# Altium schematic sheet Sheet1.SchDoc
size 500 x 350 mm; SheetNumber: 1; SheetTotal: 1
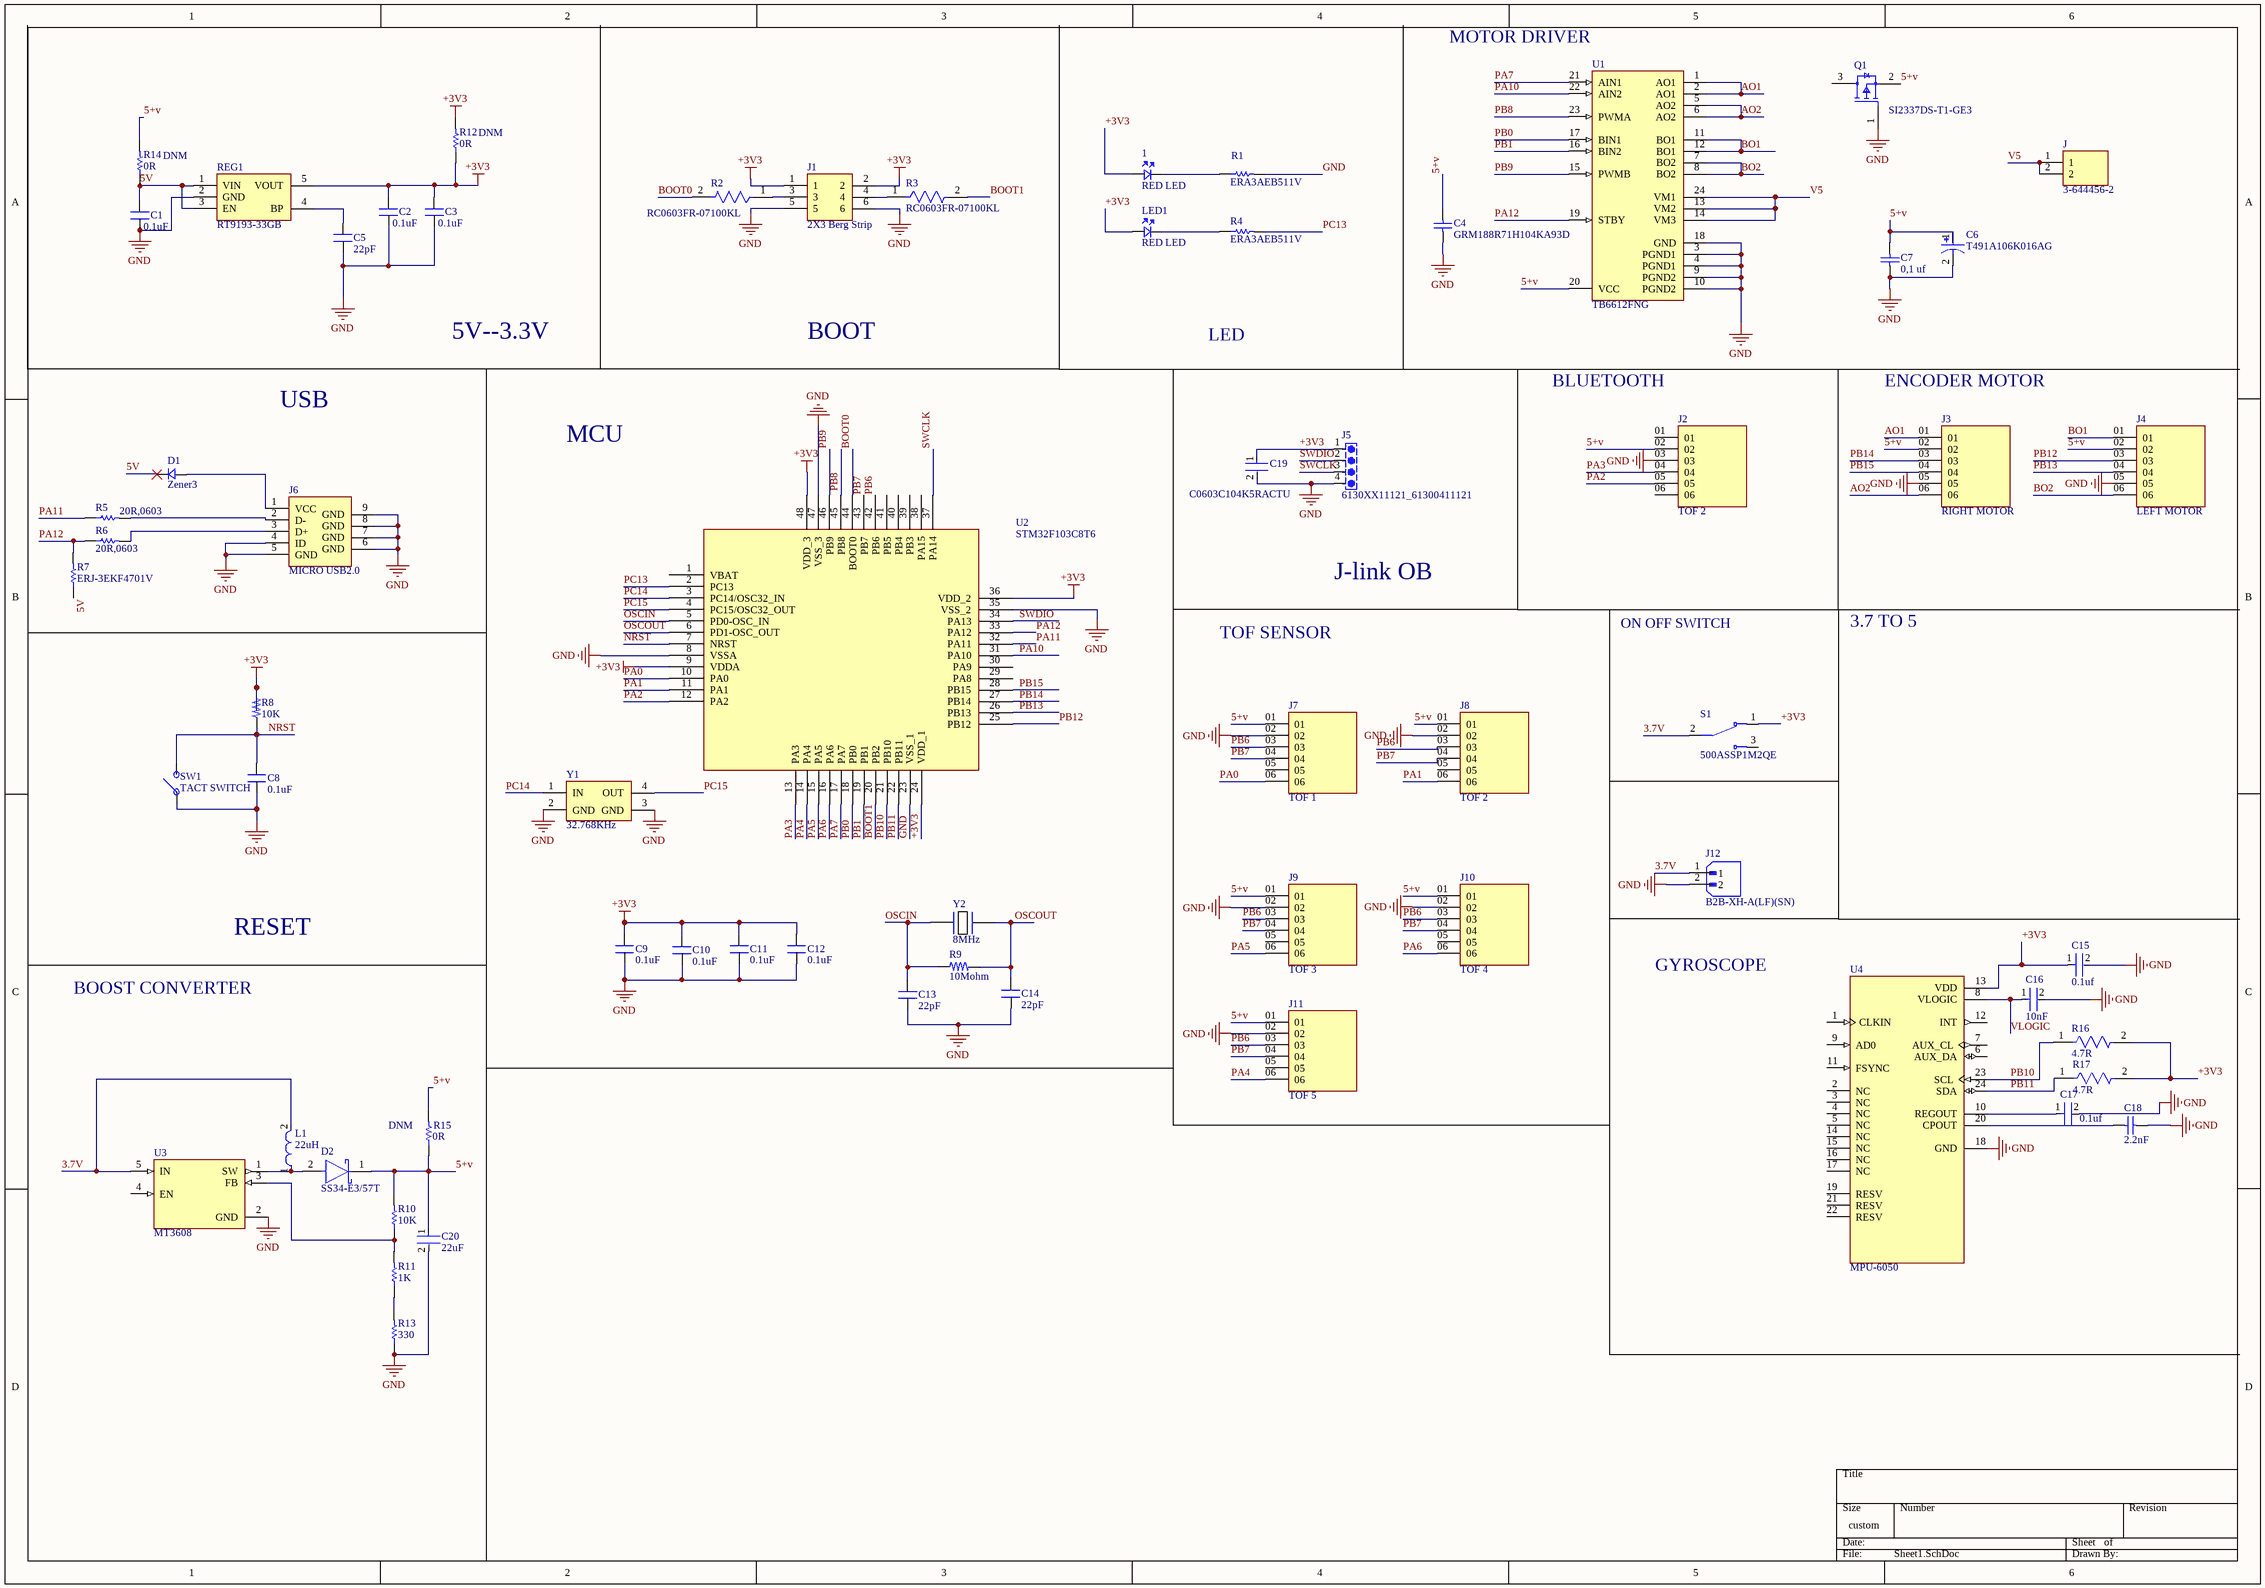
[diagram p0: Sheet1.SchDoc]

## Parts
1  RED LED  [LED_0805]
C1  0.1uF  [CAP_0805]
C2  0.1uF  [CAP_0805]
C3  0.1uF  [CAP_0805]
C4  GRM188R71H104KA93D  [CAPC1608X90X35ML10T15]
C5  22pF  [CAP_0805]
C6  T491A106K016AG  [CAPMP3216X180N]
C7  0,1 uf  [CAPC1608X90X35ML10T15]
C8  0.1uF  [CAP_0805]
C9  0.1uF  [CAP_0805]
C10  0.1uF  [CAP_0805]
C11  0.1uF  [CAP_0805]
C12  0.1uF  [CAP_0805]
C13  22pF  [CAP_0805]
C14  22pF  [CAP_0805]
C15  0.1uf  [FP-C0402-BB-MFG]
C16  10nF  [FP-C0805C-DN-MFG]
C17  0.1uf  [FP-C0402-BB-MFG]
C18  2.2nF  [CAPC2013X94X50LL20T25]
C19  C0603C104K5RACTU  [FP-C0603C-CF-MFG]
C20  22uF  [FP-GRM21B-0_15-MFG]
D1  Zener3  [DIO_SOD80C]
D2  SS34-E3/57T  [FP-95402-MFG]
J  3-644456-2  [TE_3-644456-2]
J1  2X3 Berg Strip  [CON6_100_59D78_TH_ST_Duplicate]
J2  TOF 2  [SAMTEC_MTSW-106-22-S-S-360]
J3  RIGHT MOTOR  [SAMTEC_MTSW-106-22-S-S-360]
J4  LEFT MOTOR  [SAMTEC_MTSW-106-22-S-S-360]
J5  6130XX11121_61300411121  [61300411121]
J6  MICRO USB2.0  [CON_10118192-0001LF_SMD]
J7  TOF 1  [SAMTEC_MTSW-106-22-S-S-360]
J8  TOF 2  [SAMTEC_MTSW-106-22-S-S-360]
J9  TOF 3  [SAMTEC_MTSW-106-22-S-S-360]
J10  TOF 4  [SAMTEC_MTSW-106-22-S-S-360]
J11  TOF 5  [SAMTEC_MTSW-106-22-S-S-360]
J12  B2B-XH-A(LF)(SN)  [JST_B2B-XH-A(LF)(SN)]
L1  22uH  [FP-NR6045-MFG]
LED1  RED LED  [LED_0805]
Q1  SI2337DS-T1-GE3  [FP-S-03946-IPC_A]
R1  ERA3AEB511V  [RESC1608X55X30ML20T20]
R2  RC0603FR-07100KL  [FP-RC0603-0_55-MFG]
R3  RC0603FR-07100KL  [FP-RC0603-0_55-MFG]
R4  ERA3AEB511V  [RESC1608X55X30ML20T20]
R5  20R,0603  [RESC1609X55X30ML10T20]
R6  20R,0603  [RESC1609X55X30ML10T20]
R7  ERJ-3EKF4701V  [RESC1608X55X30NL15T15]
R8  10K  [RES_0805]
R9  10Mohm  [RES_0805]
R10  10K  [RESC1609X50X30NL8T20]
R11  1K  [RESC3216X70X50LL05T20]
R12  0R  [RESC1608X55X25ML10T15]
R13  330  [RESC2013X60X40LL20T25]
R14  0R  [RESC1608X55X25ML10T15]
R15  0R  [RESC1608X55X25ML10T15]
R16  4.7R  [FP-RC0402-0_4-MFG]
R17  4.7R  [FP-RC0402-0_4-MFG]
REG1  RT9193-33GB  [SOT23-5]
S1  500ASSP1M2QE  [SW_500ASSP1M2QE]
SW1  TACT SWITCH  [SW_342_SMD]
U1  TB6612FNG  [TOSH-SSOP-24_M]
U2  STM32F103C8T6  [LQFP-48_19.6_393_58X11_SMD]
U3  MT3608  [SOT95P280X145-6N]
U4  MPU-6050  [QFN50P400X400X95-24N]
Y1  32.768KHz  [XTAL_MC-405 32.7680K-G3]
Y2  8MHz  [XTAL_314_240X47_SMD]

## Nets
+3V3: 1.A C2.1 C3.1 C9.1 C10.1 C11.1 C12.1 C15.1 C19.1 J1.1 J1.2 J5.1 LED1.A R8.2 R12.1 R12.2 R16.2 R17.2 REG1.5(VOUT) S1.1 U2.9(VDDA) U2.24(VDD_1) U2.36(VDD_2) U2.48(VDD_3) U4.13(VDD)
GND: C1.2 C2.2 C3.2 C4.1 C5.1 C6.2 C7.1 C8.2 C9.2 C10.2 C11.2 C12.2 C13.1 C14.1 C15.2 C16.2 C17.2 C18.2 C19.2 C20.2 J1.5 J1.6 J2.03 J3.05 J4.05 J5.4 J6.4(ID) J6.5(GND) J6.6(GND) J6.7(GND) J6.8(GND) J6.9(GND) J7.02 J8.02 J9.02 J10.02 J11.02 J12.2 Q1.1(G) R1.2 R13.1 REG1.2(GND) SW1.1 U1.3(PGND1) U1.4(PGND1) U1.9(PGND2) U1.10(PGND2) U1.18(GND) U2.8(VSSA) U2.23(VSS_1) U2.35(VSS_2) U2.47(VSS_3) U3.2(GND) U4.18(GND) Y1.2(GND) Y1.3(GND)
3.7V: J12.1 L1.2 S1.2 U3.5(IN)
5+v: C4.2 C6.1 C7.2 C20.1 D2.1(C) J2.02 J3.02 J4.02 J7.01 J8.01 J9.01 J10.01 J11.01 Q1.2(S) R10.2 R14.2 R15.1 R15.2 U1.20(VCC)
5V: C1.1 D1.K R7.1 R14.1 REG1.1(VIN) REG1.3(EN)
AO1: J3.01 U1.1(AO1) U1.2(AO1)
AO2: J3.06 U1.5(AO2) U1.6(AO2)
BO1: J4.01 U1.11(BO1) U1.12(BO1)
BO2: J4.06 U1.7(BO2) U1.8(BO2)
BOOT0: R2.2 U2.44(BOOT0)
BOOT1: R3.2 U2.20(PB2)
NRST: C8.1 R8.1 SW1.2 U2.7(NRST)
OSCIN: C13.2 R9.1 U2.5(PD0-OSC_IN) Y2.1
OSCOUT: C14.2 R9.2 U2.6(PD1-OSC_OUT) Y2.2
PA0: J7.06 U2.10(PA0)
PA1: J8.06 U2.11(PA1)
PA2: J2.05 U2.12(PA2)
PA3: J2.04 U2.13(PA3)
PA4: J11.06 U2.14(PA4)
PA5: J9.06 U2.15(PA5)
PA6: J10.06 U2.16(PA6)
PA7: U1.21(AIN1) U2.17(PA7)
PA10: U1.22(AIN2) U2.31(PA10)
PA11: R5.1 U2.32(PA11)
PA12: R6.1 R7.2 U1.19(STBY) U2.33(PA12)
PB0: U1.17(BIN1) U2.18(PB0)
PB1: U1.16(BIN2) U2.19(PB1)
PB6: J7.03 J8.03 J9.03 J10.03 J11.03 U2.42(PB6)
PB7: J7.04 J8.04 J9.04 J10.04 J11.04 U2.43(PB7)
PB8: U1.23(PWMA) U2.45(PB8)
PB9: U1.15(PWMB) U2.46(PB9)
PB10: R16.1 U2.21(PB10) U4.23(SCL)
PB11: R17.1 U2.22(PB11) U4.24(SDA)
PB12: J4.03 U2.25(PB12)
PB13: J4.04 U2.26(PB13)
PB14: J3.03 U2.27(PB14)
PB15: J3.04 U2.28(PB15)
PC13: R4.2 U2.2(PC13)
PC14: U2.3(PC14/OSC32_IN) Y1.1(IN)
PC15: U2.4(PC15/OSC32_OUT) Y1.4(OUT)
SWCLK: J5.3 U2.37(PA14)
SWDIO: J5.2 U2.34(PA13)
V5: J.1 J.2 U1.13(VM2) U1.14(VM3) U1.24(VM1)
VLOGIC: C16.1 U4.8(VLOGIC)
Net1_K: 1.K R1.1
NetC5_2: C5.2 REG1.4(BP)
NetC17_1: C17.1 U4.10(REGOUT)
NetC18_1: C18.1 U4.20(CPOUT)
NetD1_A: D1.A J6.1(VCC)
NetD2_2: D2.2(A) L1.1 U3.1(SW)
NetJ1_3: J1.3 R2.1
NetJ1_4: J1.4 R3.1
NetJ6_2: J6.2(D-) R5.2
NetJ6_3: J6.3(D+) R6.2
NetLED1_K: LED1.K R4.1
NetR10_1: R10.1 R11.2 U3.3(FB)
NetR11_1: R11.1 R13.2

Not connected (* = marked no-connect by the designer): J2 01 06; J7 05; J8 05; J9 05; J10 05; J11 05; Q1 3(D); S1 3; U2 1(VBAT) 29(PA8) 30(PA9) 38(PA15) 39(PB3) 40(PB4) 41(PB5); U3 4(EN); U4 1(CLKIN) 2(NC) 3(NC) 4(NC) 5(NC) 6(AUX_DA) 7(AUX_CL) 9(AD0) 11(FSYNC) 12(INT) 14(NC) 15(NC) 16(NC) 17(NC) 19(RESV) 21(RESV) 22(RESV)

## Notes on the sheet
- MOTOR DRIVER
- (near R14) DNM
- (near R12) DNM
- 5V--3.3V
- BOOT
- LED
- BLUETOOTH
- ENCODER MOTOR
- USB
- MCU
- J-link OB
- ON OFF SWITCH
- 3.7 TO 5
- TOF SENSOR
- RESET
- GYROSCOPE
- BOOST CONVERTER
- (near R15) DNM

## Library data of the parts
1 LED1 = LED-RED_10mA-0805: Red 621nm LED Indication - Discrete 2V 0805 (2012 Metric); Manufacturer: Lite-On Inc.; Manufacturer Part Number: LTST-C170EKT; Case/ Package: 0805; Supplier-1: Digikey; Supplier Part Number-1: 160-1178-1-ND
C1-C3 C8-C12 = CAP_0.1uF-50V-5%-0805: 0.1µF ±5% 50V Ceramic Capacitor X7R 0805 (2012 Metric); Manufacturer: KEMET; Manufacturing Part Number: C0805C104J5RACTU; Case/Package: 0805 (2012 Metric); Supplier-1: Digikey; Supplier Part Number-1: 399-1171-1-ND
C4 C7 = CMP-2100-03643-1: Chip Capacitor, 0.1 uF, +/- 10%, 50 V, -55 to 125 degC, 0603 (1608 Metric), RoHS, Tape and Reel; Manufacturer: Murata; Dielectric Material: Ceramic; Voltage Rating: 50V; Capacitance: 100nF; Dielectric: X7R; Insulation Resistance: 10GR; Case Code (Metric): 1608; Lead Free: LeadFree; Depth: 0.8mm; Number of Pins: 2; Radiation Hardening: No; Case/Package: 0603; Manufacturer URL: http://www.murata.com/; Packaging: TapeandReel; Length: 1.6mm; Contact Plating: Tin; Datasheet URL: http://psearch.en.murata.com/capacitor/product/GRM188R71H104KA93%23.pdf; Tolerance: 10%; Case Code (Imperial): 0603; Min Operating Temperature: -55degC; RoHSCompliant: true; Voltage: 50V; Termination: SMD/SMT; Mount: SurfaceMount; Material: Ceramic; Package Quantity: 1; Height: 0.8mm; Thickness: 0.035inch; REACH SVHC: NoSVHC; Max Operating Temperature: 125degC; Width: 0.8mm; Package Reference: 0603; Voltage Rating (DC): 50V; Datasheet Version: 42675.0; Package Description: 2-Pin Surface Mount Device, Body 1.6 x 0.8 mm
C5 C13 C14 = CAP_22pF-50V-5%-0805: 22pF ±5% 50V Ceramic Capacitor C0G, NP0 0805 (2012 Metric); Manufacturer: KEMET; Manufacturer Part Number: C0805C220J5GACTU; Case/Package: 0805; Supplier-1: Digikey; Supplier Part Number-1: 399-1113-1-ND
C6 = T491A106K016AG: 10ÂµF Molded Tantalum Capacitors 16V 1206 (3216 Metric) 3Ohm; MF: KEMET; Price: None; Value: *; Check_prices: https://www.snapeda.com/parts/T491A106K016AG/KEMET/view-part/1691630/?ref=eda; Package: 1206 KEMET; SnapEDA_Link: https://www.snapeda.com/parts/T491A106K016AG/KEMET/view-part/1691630/?ref=snap; MP: T491A106K016AG; Purchase-URL: https://pricing.snapeda.com/search/part/T491A106K016AG/?ref=eda; Availability: Warning
C15 C17 = CMP-2008-02108-2: CAP CER 0.1UF 16V X7R 0402; Manufacturer: Kemet; Manufacturer Part Number: C0402C104K4RACTU; Value: 0.10 μF; Tolerance: 0.1; Material: Ceramic; Temperature Coefficient: 15%; Voltage Rating: 16 V; Package: C0402-BB; Automotive: No; Ipc Land Pattern Name: CAPC10050X50; Device Class L3: Ceramic Capacitors; Capacitance: 0.10 μF; Octopart: https://octopart.com/c0402c104k4ractu-kemet-94158; Temperature Characteristic: X7R; Mouser Description: Cap Ceramic 0.1uF 16V X7R 10% SMD 0402 125?C Paper T/R - Tape and Reel (Alt: C0402C104K4RAC TU); ComponentLink2Description: Datasheet; Temperature Range Low: -55°C; RoHS: TRUE; Device Class L1: Passive Components; Temperature Range High: +125°C; Device Class L2: Capacitors; ComponentLink2URL: https://content.kemet.com/datasheets/KEM_C1002_X7R_SMD.pdf; Category: Cap; Height: 0.55mm; Temperature: -55°C to +125°C; Lead Free: Yes; Digikey Description: CAP CER 0.1UF 16V X7R 0402
C16 = CMP-2007-00259-2: CAP CER 10000PF 200V X7R 0805; Manufacturer Part Number: C0805C103K2RACTU; Manufacturer: KEMET; Material: Ceramic; Temperature Coefficient: 30ppm/°C; Capacitance: 10,000 pF; Tolerance: 0.1; Value: 10,000 pF; Device Class L2: Capacitors; Voltage Rating: 200 V; Temperature Range High: +125°C; ComponentLink2Description: Datasheet; Height: 0.88mm; Octopart: https://octopart.com/c0805c103k2ractu-kemet-9138347; ComponentLink2URL: https://content.kemet.com/datasheets/KEM_C1003_C0G_SMD.pdf; Category: Cap; Temperature: -55°C to +125°C; Temperature Range Low: -55°C; Digikey Description: CAP CER 10000PF 200V X7R 0805; Temperature Characteristic: X7R; Automotive: No; Device Class L3: Ceramic Capacitors; Mouser Description: KEMET - C0805C103K2RACTU - CAP, MLCC, X7R, 10NF, 200V, 0805; RoHS: TRUE; Device Class L1: Passive Components; Lead Free: Yes; Package: C0805C-DN; Ipc Land Pattern Name: CAPC200125X78
C18 = CMP-2007-04184-1: Part Number: 08051C222JAT2A; Manufacturer: AVX Interconnect / Elco
C19 = CMP-2006-03061-2: CAP CER 0.1UF 50V X7R 0603; Manufacturer: KEMET; Tolerance: 0.1; Temperature Coefficient: 30ppm/°C; Material: Ceramic; Automotive Grade: Grade 1; Value: 0.10 μF; Temperature: -55°C to +125°C; RoHS: TRUE; Temperature Range High: +125°C; Lead Free: Yes; Octopart: https://octopart.com/c0603c104k5ractu-kemet-139244; Digikey Description: CAP CER 0.1UF 50V X7R 0603; Category: Cap; Package: C0603C-CF; ComponentLink2Description: Datasheet; Temperature Range Low: -55°C; Device Class L1: Passive Components; Voltage Rating: 50 V; Automotive: Yes; Device Class L3: Ceramic Capacitors; ComponentLink2URL: https://api.kemet.com/component-edge/download/datasheet/C0603C100J5GACAUTO.pdf; Capacitance: 0.10 μF; Device Class L2: Capacitors; Manufacturer Part Number: C0603C104K5RACTU; Temperature Characteristic: X7R; Height: 0.87mm
C20 = CMP-2007-03385-2: Chip Multilayer Ceramic Capacitors for General Purpose, 0805, 22uF, X5R, 15%, 20%, 6.3V; Material: Ceramic; Max Operating Temperature: 85°C; Voltage: 6.3V; Min Operating Temperature: -55°C; Case/Package: 0805; Thickness: 0.053inch; Dielectric: X5R; Packaging: Tape and Reel; Depth: 1.25mm; Termination: SMD/SMT; Voltage Rating (DC): 6.3V; Radiation Hardening: No; Tolerance: 20%; Mount: Surface Mount; Lead Free: Lead Free; Package Quantity: 1; REACH SVHC: No SVHC; Voltage Rating: 6.3V; Capacitance: 22uF; Length: 2mm; Case Code (Imperial): 0805; Case Code (Metric): 2012; Width: 0.049inch; Height: 1.25mm
D1 = DIO-Z_3.3V-0.5W-SOD80C: Zener Diode 3.3V 500mW ±5% Surface Mount LLDS; MiniMelf; Manufacturer: Nexperia USA Inc.; Manufacturing Part Number: BZV55-C3V3,115; Case/Package: SOD80C; Supplier-1: Digikey; Supplier Part Number-1: 1727-4970-1-ND
D2 = CMP-02539-000012-1: DIODE SCHOTTKY 40V 3A DO214AB; Manufacturer: Vishay; Max Junction Temp: +150°C; Peak Reverse Current: 0.5mA; Max Surge Forward Current: 100A; Standoff Height: 0mm; ComponentLink2Description: Datasheet; Device Class L3: Schottky Diodes; Height: 2.62mm; Max Repetitive Reverse Voltage: 40V; Lead Free: Yes; Package: 95402; Temperature Range High: +150°C; ComponentLink2URL: http://www.vishay.com/docs/88751/ss32.pdf; Temperature: -55°C to +150°C; Footprint Url: http://www.vishay.com/docs/95402/smc.pdf; Automotive: No; Forward Current: 3A; Category: Diode; Manufacturer Part Number: SS34-E3/57T; RoHS: TRUE; Device Class L2: Diodes; Mouser Description: Schottky Diodes & Rectifiers 3.0 Amp 40 Volt; Octopart: https://octopart.com/ss34-e3%2F57t-vishay-39552907; Temperature Range Low: -55°C; Device Class L1: Discrete Semiconductors; Digikey Description: DIODE SCHOTTKY 40V 3A DO214AB
J = 3-644456-2: Connector Unshrouded Header HDR 2 Position 2.54mm Solder Straight Thru-Hole; Number_of_Positions: 2; Centerline_Pitch: 2.54 mm[.1 in]; MF: TE Connectivity; Digi-Key_Part_Number: A31112-ND; Product_Type: Connector; TE_purchase_URL: https://www.te.com/usa-en/product-3-644456-2.html?te_bu=Cor&te_type=disp&te_campaign=seda_glo_cor-seda-global-disp-prtnr-fy19-seda-model-bom-cta_sma-317_1&elqCampaignId=32493; Value: *; MP: 3-644456-2; Package: None; SnapEDA_Link: https://www.snapeda.com/parts/3-644456-2/TE%20Connectivity%20AMP%20Connectors/view-part/520887/?ref=snap; EU_RoHS_Compliance: Compliant; Digi-Key_Purchase_URL: https://www.digikey.com/product-detail/en/te-connectivity-amp-connectors/3-644456-2/A31112-ND/698344?utm_source=snapeda&utm_medium=aggregator&utm_campaign=symbol
J1 = CON-BS-PLG_2X3-100-TH-ST: 6 pin, 2 row, 2.54mm pitch bergstrip; Manufacturer: NA; Manufacturer Part Number: NA; Case/Package: TH; Supplier-1: NA; Supplier Part Number-1: NA
J2-J4 J7-J11 = MTSW-106-22-S-S-360: Price: None; Value: *; MP: MTSW-106-22-S-S-360; Package: None; Availability: Unavailable
J5 = 6130XX11121_61300411121: 4 pins, 1 row, straight, gold plating; MF: Wurth Electronics; SnapEDA_Link: https://www.snapeda.com/parts/61300411121/Wurth+Electronics/view-part/?ref=snap; Package: None; Value: *; MP: 61300411121; Check_prices: https://www.snapeda.com/parts/61300411121/Wurth+Electronics/view-part/?ref=eda
J6 = CON-USB_10118192-0002LF-SMD: USB - micro B USB 2.0 Receptacle Connector 5 Position Surface Mount, Right Angle; Manufacturer: Amphenol ICC (FCI); Manufacturing Part Number: 10118192-0002LF; Case/Package: SMD; Supplier-1: Digikey; Supplier Part Number-1: 609-5379-1-ND
J12 = B2B-XH-A(LF)(SN): Connector Header Through Hole 2 position 0.098 (2.50mm); MF: JST Sales America Inc.; SnapEDA_Link: https://www.snapeda.com/parts/B2B-XH-A(LF)(SN)/JST+Sales+America+Inc./view-part/?ref=snap; Package: None; Value: *; MP: B2B-XH-A(LF)(SN); Check_prices: https://www.snapeda.com/parts/B2B-XH-A(LF)(SN)/JST+Sales+America+Inc./view-part/?ref=eda
L1 = CMP-14484-000872-1: Shielded Wirewound Inductor 22uH 20% 1.5A 0.1495Ω SMD; DC Resistance (DCR): 149.5mR; Self Resonant Frequency: 7MHz; Core Material: Ferrite; Saturation Current: 1.9A; Test Frequency: 100kHz; Mount: Surface Mount; RMS Current (Irms): 1.5A; Packaging: Tape and Reel; RoHS Compliant: Yes; Termination: SMD/SMT; Resistor Type: Wirewound; Inductance: 22uH; Inductance Tolerance: 20%; Number of Pins: 2; Series: NR; Height: 4.5mm; Package Quantity: 1500; Shielding: Shielded; Max Operating Temperature: 120°C; Length: 0.236inch; Halogen Free: Halogen Free; Width: 0.236inch; Min Operating Temperature: -25°C; Current Rating: 1.5A; Height - Seated (Max): 0.177inch; Case/Package: Nonstandard; Max DC Current: 1.5A; Tolerance: 20%
Q1 = CMP-02550-000312-1: MOSFET P-CH 80V 2.2A SOT23-3; Rise Time: 18ns; Power Dissipation: 760mW; Number of Channels: 1; Gate to Source Voltage (Vgs): 20V; Polarity: P-CHANNEL; Drain to Source Voltage (Vdss): -80V; On-State Resistance: 270MR; Threshold Voltage: -4V; Input Capacitance: 500pF; Element Configuration: Single; Fall Time: 12ns; Turn-On Delay Time: 15ns; Turn-Off Delay Time: 20ns; Continuous Drain Current (ID): 1.2A; Number of Pins: 3; Height: 1.02mm; Radiation Hardening: No; Mount: Surface Mount; Packaging: Tape and Reel; Drain to Source Breakdown Voltage: -80V; Contact Plating: Tin; Case/Package: SOT-23-3; Lead Free: Lead Free; Series: TrenchFET®; Drain-source On Resistance-Max: 270MR; Width: 1.4mm; Nominal Vgs: -4V; Length: 3.04mm; Reach SVHC Compliant: Yes; RoHS Compliant: Yes; Weight: 0.050717oz; Package Quantity: 1; Rds On Max: 270mR; Drain to Source Resistance: 270mR; Min Operating Temperature: -55°C; Number of Elements: 1; Max Power Dissipation: 760mW; Max Operating Temperature: 150°C
R1 R4 = CMP-2000-00084-1: Manufacturer: Panasonic; Part Number: ERA3AEB511V
R2 R3 = CMP-2100-03662-2: RES SMD 100K OHM 1% 1/10W 0603; Voltage Rating (DC): 50V; Resistance: 100kR; Max Power Dissipation: 100mW; Temperature Coefficient: 100ppm/°C; Working Voltage: 75V; Length: 1.6mm; Lead Free: Lead Free; Number of Terminations: 2; Packaging: Tape and Reel; Voltage Rating: 50V; Termination: SMD/SMT; Width: 0.8mm; Resistor Type: Thick Film; Resistance Tolerance: 1%; Features: Moisture Resistant; Height: 0.45mm; Construction: Rectangular; Case/Package: 0603; Military Standard: Not; Case Code (Imperial): 0603; Series: RC; Technology: THICK FILM; Depth: 0.8mm; RoHS Compliant: Yes; REACH SVHC: No SVHC; Min Operating Temperature: -55°C; Case Code (Metric): 1608; Max Operating Temperature: 155°C; Power Rating: 100mW; Number of Pins: 2; Tolerance: 1%
R5 R6 = CMP-2000-03731-1: Manufacturer: Vishay Dale; Part Number: TNPW060320R0BEEA
R7 = CMP-1012-00586-3: Precision Thick Film Chip Resistor, 4.7 KOhm, +/- 1%, -55 to 155 degC, 0603 (1608 Metric), RoHS, Tape and Reel; Resistance: 220 Ohm; Voltage Rating: 50 V; Elements: 4; Case\Package: 1205; Tolerance: 5%; Power Rating: 250 mW; PackageReference: 0603; Max Operating Temperature: 125 degC; REACH SVHC: No SVHC; Width: 0.063 inch; Length: 0.126 inch; Height: 0.024 inch; Mount: Surface Mount; Package Quantity: 1; DatasheetVersion: Apr-15; ComponentLink1Description: Manufacturer URL; Min Operating Temperature: -55 degC; Packaging: Tape and Reel; Radiation Hardening: No; ComponentLink2URL: http://industrial.panasonic.com/cdbs/www-data/pdf/RDA0000/AOA0000C86.pdf; Case Code (Metric): 3216; Pins: 8; Case Code (Imperial): 1206; Type (Resistor): Thick Film; RoHSCompliant: true; ComponentLink2Description: Datasheet; PackageDescription: 2-Pin Surface Mount Device, Body 1.6 x 0.85 mm; ComponentLink1URL: http://www.panasonic.com/
R8 = RES_10K-0.125W-1%-0805: 10 kOhms ±1% 0.125W, 1/8W Chip Resistor 0805 (2012 Metric) Moisture Resistant Thick Film; Manufacturer: Yageo; Manufacturing Part Number: RC0805FR-0710KL; Case/Package: 0805; Supplier-1: Digikey; Supplier Part Number-1: 311-10.0KCRCT-ND
R9 = RES_10MOHM-0.125W-1%-0805: 10 MOhms ±1% 0.125W, 1/8W Chip Resistor 0805 (2012 Metric) Automotive AEC-Q200, High Voltage Thick Film; Manufacturer: Rohm Semiconductor; Manufacturing Part Number: KTR10EZPF1005; Case/Package: 0805 (2012 Metric); Supplier-1: Digikey; Supplier Part Number-1: RHM10.0MAHCT-ND
R10 = CMP-1666-00005-4: Chip Resistor, 10 KOhm, +/- 1%, 100 mW, -55 to 155 degC, 0603 (1608 Metric), RoHS, Tape and Reel; Manufacturer: Vishay Semiconductor; Voltage Rating: 75 V; Max Operating Temperature: 155 degC; PackageDescription: 2-Pin Surface Mount Device, Body 1.575 x 0.85 mm; ComponentLink1Description: Manufacturer URL; RoHSCompliant: true; PackageReference: 0603; REACH SVHC: Unknown; Length: 1.55 mm; DatasheetVersion: 06/2012; Packaging: Tape and Reel; Min Operating Temperature: -55 degC; Mounting Technology: Surface Mount; ComponentLink2URL: https://datasheet.ciiva.com/11809/0900766b80d98afc-11809037.pdf; Height: 0.45 mm; ComponentLink2Description: Datasheet; Package Quantity: 5000; ComponentLink1URL: http://www.vishay.com/
R11 = CMP-2003-00017-1: Manufacturer: Panasonic; Part Number: ERJ-8ENF1001V
R12 R14 R15 = CMP-2100-03667-1: Chip Resistor, 0 Ohm, +/- 5%, 0.1 W, -55 to 155 degC, 0603 (1608 Metric), RoHS, Tape and Reel; Manufacturer: Yageo; Temperature Coefficient: 200ppm/degreesC; Voltage Rating: 50V; Power Rating: 100mW; Resistance: 0mOhm; Width: 0.8mm; Max Operating Temperature: 155degC; Tolerance: 5%; Package Reference: 0603; Height: 0.45mm; Depth: 0.8mm; Package Description: 2-Pin Surface Mount Device, Body 1.6 x 0.8 mm; Termination: SMD/SMT; Package Quantity: 5000; Case/Package: 0603; Case Code (Imperial): 0603; Radiation Hardening: No; Number of Pins: 2; Length: 1.6mm; Lead Free: LeadFree; Voltage Rating (DC): 50V; Military Standard: Not; Datasheet URL: http://www.yageo.com/NewPortal/yageodocoutput?fileName=/pdf/R-Chip/PYu-RC_Group_51_RoHS_L_5.pdf; Manufacturer URL: http://www.yageo.com/; Packaging: TapeandReel; Case Code (Metric): 1608; Min Operating Temperature: -55degC; Composition: ThickFilm; RoHSCompliant: true; Contact Plating: Tin; Datasheet Version: Rev. 5, 10/2016; REACH SVHC: NoSVHC
R13 = CMP-2001-00628-1: Manufacturer: Panasonic; Part Number: ERA6AEB331V
R16 R17 = CMP-2002-08011-2: Tolerance: 5%; Power Rating: 63mW; Resistance: 4.7kΩ; Voltage Rating: 50V; Temperature Coefficient: 100ppm/°C; Composition: Thick Film; Max Operating Temperature: 155°C; Case/Package: 0402; Depth: 500µm; Packaging: Tape & Reel; Number of Pins: 2; Schedule B: 8533210045, 8533210045; Case Code (Imperial): 0402; Termination: SMD/SMT; Military Standard: Not; Lead Free: Lead Free; Width: 500µm; REACH SVHC: No SVHC; Max Power Dissipation: 63mW; Voltage Rating (AC): 50V; Features: Moisture Resistant; Min Operating Temperature: -55°C; Number of Terminations: 2; RoHS: Compliant; Height: 350µm; Voltage Rating (DC): 50V; Length: 1mm
REG1 = REG_3.3V-5.5V-0.3A-SOT-23-5: Linear Voltage Regulator IC 1 Output 300mA SOT-23-5; Manufacturer: Richtek USA Inc.; Manufacturer Part Number: RT9193-33GB; Case/ Package: SOT-23-5; Supplier-1: Digikey; Supplier Part Number-1: 1028-1014-1-ND
S1 = 500ASSP1M2QE: 1P2T Sub-miniature Slide Switch; MF: E-Switch; Check_prices: https://www.snapeda.com/parts/500ASSP1M2QE/E-Switch/view-part/?ref=eda; Value: *; Availability: In Stock; MP: 500ASSP1M2QE; Price: None; Package: None; SnapEDA_Link: https://www.snapeda.com/parts/500ASSP1M2QE/E-Switch/view-part/?ref=snap; Purchase-URL: https://pricing.snapeda.com/search/part/500ASSP1M2QE/?ref=eda
SW1 = SW_KSR223GLFG-SMD: Tactile Switch SPST-NO Top Actuated Surface Mount; Manufacturer: C&K; Manufacturing Part Number: KSR223GLFG; Case/Package: SMD; Supplier-1: Digikey; Supplier Part Number-1: 401-1704-1-ND
U1 = CMP-1773-00001-1: Driver IC for Dual DC Motor, 15 V, -20 to 85 degC, 24-Pin SSOP, RoHS, Tape and Reel; Elements: 2; Max Power Dissipation: 200 mW; Max Surge Current: 100 mA; Element Configuration: Common Cathode; Case\Package: TO-236-3; Forward Voltage: 1 V; Peak Reverse Current: 0.1 uA; Forward Current: 70 mA; Recovery Time: 5 ns; Radiation Hardening: No; Packaging: Tape and Reel; ComponentLink2Description: Datasheet; REACH SVHC: No SVHC; ComponentLink2URL: https://toshiba.semicon-storage.com/info/docget.jsp?did=10660&prodName=TB6612FNG; RoHSCompliant: true; DatasheetVersion: Oct-14; PackageDescription: 24-Pin Shrink Small Outline Package Integrated Circuit, Body 7.8 x 5.6 mm, Pitch 0.65 mm; Package Quantity: 3000; Length: 3 mm; Pins: 3; Mount: Surface Mount; ComponentLink1Description: Manufacturer URL; PackageReference: SSOP-24; ComponentLink1URL: http://www.toshiba.com/; Width: 1.4 mm; Max Operating Temperature: 125 degC; Height: 1.1 mm; Min Operating Temperature: -55 degC
U2 = IC-STM32F103C8T6 _1: ARM® Cortex®-M3 STM32F1 Microcontroller IC 32-Bit 72MHz 64KB (64K x 8) FLASH; Manufacturer: STMicroelectronics; Manufacturer Part Number: STM32F103C8T6; Case/Package: 48-LQFP; Supplier-1: Digikey; Supplier Part Number-1: 497-6063-ND
U3 = MT3608: High Efficiency 1.2MHz2A Step Up Converter; MF: Aerosemi Technology Co., Ltd; Price: None; Availability: Not in stock; Package: Package; MP: MT3608; Value: *; SnapEDA_Link: https://www.snapeda.com/parts/MT3608/Aerosemi+Technology+Co.%252C+Ltd/view-part/?ref=snap; Check_prices: https://www.snapeda.com/parts/MT3608/Aerosemi+Technology+Co.%252C+Ltd/view-part/?ref=eda
U4 = MPU-6050: MPU-6050 series Accelerometer, Gyroscope, 3 Axis Sensor Evaluation Board; MF: TDK InvenSense; SnapEDA_Link: https://www.snapeda.com/parts/MPU-6050/TDK+InvenSense/view-part/?ref=snap; Package: QFN-24 InvenSense; Value: *; MP: MPU-6050; Check_prices: https://www.snapeda.com/parts/MPU-6050/TDK+InvenSense/view-part/?ref=eda
Y1 = XTAL_32.768KHz-MC-405 32.7680K-G3: Crystals SMD AT XTL MHZ +/-50PPM 12.5 PF 250 T/R; Manufacturer: Epson; Manufacturing Part Number: MC-405 32.7680K-G3: ROHS; Case/Package: SMD; Supplier-1: Mouser; Supplier Part Number-1: 732-MC405327680KG3RS
Y2 = XTAL_8MHZ-LFXTAL030234: Crystals 8MHz 22pF -20C 70C; Manufacturer: IQD Frequency Products; Manufacturing Part Number: LFXTAL030234Reel; Case/Package: SMD; Supplier-1: Mouser; Supplier Part Number-1: 449-LFXTAL030234REEL